# Altium schematic sheet v1.0.SchDoc
size 50 x 50 mm
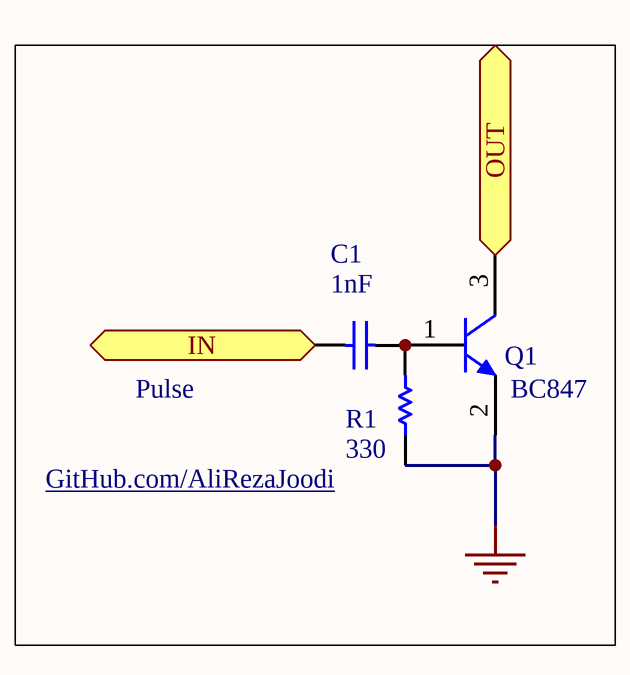
[diagram p0: v1.0.SchDoc]

## Parts
C1  value 1nF  [RESC3216N]  (hidden comment: Cap)
Q1  value BC847  [SOT23-3N]  (hidden comment: NPN)
R1  value 330  [0805]  (hidden comment: Res1)

## Ports
IN (in), OUT (out)

## Nets
GND: Q1.2(E) R1.1
IN: C1.1 ; port IN
OUT: Q1.3(C) ; port OUT
NetC1_2: C1.2 Q1.1(B) R1.2

## Notes on the sheet
- Pulse
- (near R1) GitHub.com/AliRezaJoodi

## Library data of the parts
C1 = Cap: Capacitor; Published: 8-Jun-2000; LatestRevisionDate: 17-Jul-2002; LatestRevisionNote: Re-released for DXP Platform.; PackageReference: RAD-0.3; Publisher: Altium Limited
Q1 = BC847: Silicon Bipolar Transistor
R1 = Res1: Resistor; Published: 8-Jun-2000; LatestRevisionDate: 17-Jul-2002; LatestRevisionNote: Re-released for DXP Platform.; PackageReference: AXIAL-0.3; Publisher: Altium Limited